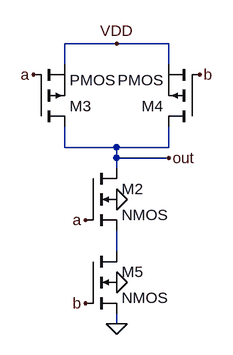
[diagram p0: schematic NAND.asc]
NAND.asc, the LTspice schematic file:
Version 4
SHEET 1 880 680
WIRE 240 -48 160 -48
WIRE 320 -48 240 -48
WIRE 160 -16 160 -48
WIRE 320 -16 320 -48
WIRE 160 112 160 80
WIRE 240 112 160 112
WIRE 320 112 320 80
WIRE 320 112 240 112
WIRE 240 128 240 112
WIRE 320 128 240 128
WIRE 240 144 240 128
WIRE 240 272 240 240
WIRE 240 384 240 368
FLAG 240 384 0
FLAG 192 224 a
FLAG 112 0 a
FLAG 368 0 b
FLAG 192 352 b
FLAG 240 -48 VDD
FLAG 320 128 out
FLAG 240 192 0
FLAG 240 320 0
SYMBOL pmos 112 80 M180
SYMATTR InstName M3
SYMBOL pmos 368 80 R180
SYMATTR InstName M4
SYMBOL nmos4 192 144 R0
SYMATTR InstName M2
SYMBOL nmos4 192 272 R0
SYMATTR InstName M5

The netlist it stands for:
* NAND.asc
M3 out a VDD VDD PMOS
M4 out b VDD VDD PMOS
M2 out a N001 0 NMOS
M5 N001 b 0 0 NMOS
.model NMOS NMOS
.model PMOS PMOS
.lib standard.mos
.backanno
.end